# Altium schematic sheet TEMP.SchDoc
size A; SheetNumber: 1; SheetTotal: 8
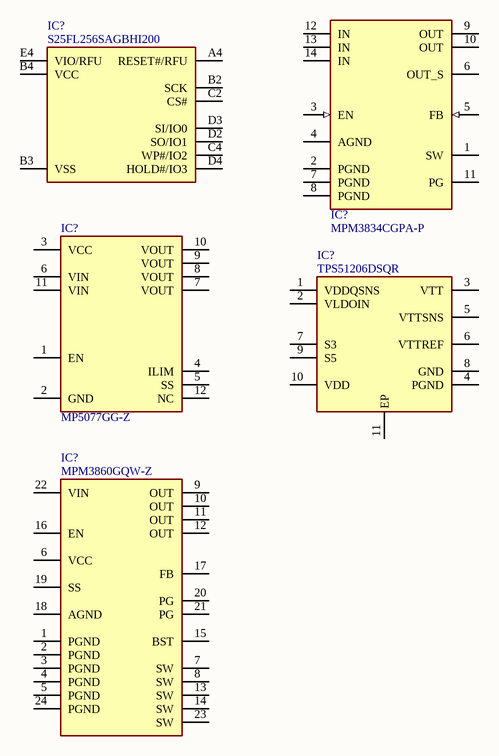
[diagram p0: TEMP.SchDoc]

## Parts
(Parts that share a designator on the sheet are numbered #1, #2 ... from top to bottom, then left to right.)
IC?#1  S25FL256SAGBHI200  [BGA24C100P4X6_600X800X120]
IC?#2  MPM3834CGPA-P  [MPM3834CGPAP]
IC?#3  MP5077GG-Z  [MP5077GGZ]
IC?#4  TPS51206DSQR  [SON40P200X200X80-11N]
IC?#5  MPM3860GQW-Z  [MPM3650CGQWZ]

## Nets

Not connected (* = marked no-connect by the designer): IC?#1 A1(NC_1) A2(NC_2) A3(NC_3) A4(RESET#/RFU) B1(DNU_1) B2(SCK) B3(VSS) B4(VCC) C1(DNU_2) C2(CS#) C3(RFU) C4(WP#/IO2) D1(DNU_3) D2(SO/IO1) D3(SI/IO0) D4(HOLD#/IO3) E1(NC_4) E2(NC_5) E3(NC_6) E4(VIO/RFU) F1(NC_7) F2(NC_8) F3(NC_9) F4(NC_10); IC?#2 1(SW) 2(PGND) 3(EN) 4(AGND) 5(FB) 6(OUT_S) 7(PGND) 8(PGND) 9(OUT) 10(OUT) 11(PG) 12(IN) 13(IN) 14(IN); IC?#3 1(EN) 2(GND) 3(VCC) 4(ILIM) 5(SS) 6(VIN) 7(VOUT) 8(VOUT) 9(VOUT) 10(VOUT) 11(VIN) 12(NC); IC?#4 1(VDDQSNS) 2(VLDOIN) 3(VTT) 4(PGND) 5(VTTSNS) 6(VTTREF) 7(S3) 8(GND) 9(S5) 10(VDD) 11(EP); IC?#5 1(PGND) 2(PGND) 3(PGND) 4(PGND) 5(PGND) 6(VCC) 7(SW) 8(SW) 9(OUT) 10(OUT) 11(OUT) 12(OUT) 13(SW) 14(SW) 15(BST) 16(EN) 17(FB) 18(AGND) 19(SS) 20(PG) 21(PG) 22(VIN) 23(SW) 24(PGND)

## Library data of the parts
IC?#1 = S25FL256SAGBHI200: Integrated Circuit; Manufacturer_Name: Infineon; Datasheet Link: https://www.cypress.com/file/448601/download; Height: 1.2mm; Manufacturer_Part_Number: S25FL256SAGBHI200; Mouser Part Number: 797-25FL256SAGBHI200; Mouser Price/Stock: https://www.mouser.co.uk/ProductDetail/Infineon-Technologies/S25FL256SAGBHI200?qs=%252B97ACBfLqz%2F7D9cRggMsKA%3D%3D; Arrow Part Number: S25FL256SAGBHI200; Arrow Price/Stock: https://www.arrow.com/en/products/s25fl256sagbhi200/infineon-technologies-ag?utm_currency=USD&region=nac
IC?#2 = MPM3834CGPA-P: Integrated Circuit; Manufacturer_Name: Monolithic Power Systems (MPS); Datasheet Link: https://www.monolithicpower.com/en/documentview/productdocument/index/version/2/document_type/Datasheet/lang/en/sku/MPM3834CGPA/document_id/9651/; Height: 1.31mm; Manufacturer_Part_Number: MPM3834CGPA-P; Mouser Part Number: 946-MPM3834CGPA-P; Mouser Price/Stock: https://www.mouser.co.uk/ProductDetail/Monolithic-Power-Systems-MPS/MPM3834CGPA-P?qs=By6Nw2ByBD1gcNTTHPVSOg%3D%3D
IC?#3 = MP5077GG-Z: Integrated Circuit; Manufacturer_Name: Monolithic Power Systems (MPS); Datasheet Link: http://www.monolithicpower.com/DesktopModules/DocumentManage/API/Document/getDocument?id=3265; Height: 1mm; Manufacturer_Part_Number: MP5077GG-Z; Mouser Part Number: 946-MP5077GG-Z; Mouser Price/Stock: https://www.mouser.co.uk/ProductDetail/Monolithic-Power-Systems-MPS/MP5077GG-Z?qs=AfGmtpoX2ghv3QovAD4CRg%3D%3D
IC?#4 = TPS51206DSQR: Integrated Circuit; Manufacturer_Name: Texas Instruments; Datasheet Link: http://www.ti.com/lit/ds/symlink/tps51206.pdf; Height: 0.8mm; Manufacturer_Part_Number: TPS51206DSQR; Mouser Part Number: 595-TPS51206DSQR; Mouser Price/Stock: https://www.mouser.co.uk/ProductDetail/Texas-Instruments/TPS51206DSQR?qs=%252BG2H6gVb6ixLbD%2FQxTGyiQ%3D%3D; Arrow Part Number: TPS51206DSQR; Arrow Price/Stock: https://www.arrow.com/en/products/tps51206dsqr/texas-instruments?region=nac
IC?#5 = MPM3860GQW-Z: Integrated Circuit; Manufacturer_Name: Monolithic Power Systems (MPS); Datasheet Link: https://www.monolithicpower.com/en/documentview/productdocument/index/version/2/document_type/Datasheet/lang/en/sku/MPM3860GQW-Z/document_id/8686/; Height: 1.65mm; Manufacturer_Part_Number: MPM3860GQW-Z; Mouser Part Number: 946-MPM3860GQW-Z; Mouser Price/Stock: https://www.mouser.co.uk/ProductDetail/Monolithic-Power-Systems-MPS/MPM3860GQW-Z?qs=vmHwEFxEFR%2FBBZgXfldbaA%3D%3D